# EAGLE design main (EAGLE 7.2.0)
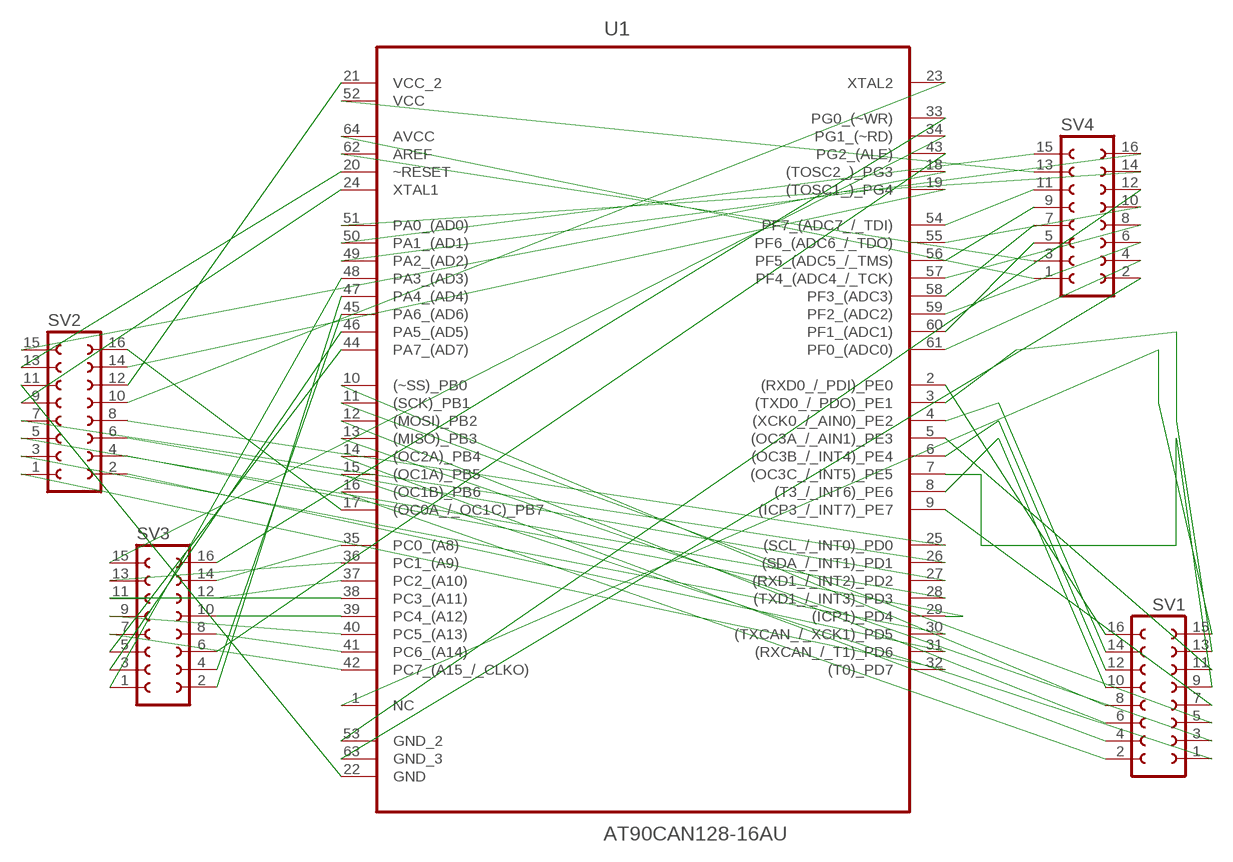
[diagram p0: schematic, sheet 1]

## Parts
SV1  FE08-2  [FE08-2]
SV2  FE08-2  [FE08-2]
SV3  FE08-2  [FE08-2]
SV4  FE08-2  [FE08-2]
U1  AT90CAN128-16AU  [QFP80P1600X1600X120-64N]

## Nets
N$1: SV4.12 U1.53(GND_2)
N$2: SV1.16 U1.2((RXD0_/_PDI)_PE0)
N$3: SV1.14 U1.4((XCK0_/_AIN0)_PE2)
N$4: SV1.12 U1.6((OC3B_/_INT4)_PE4)
N$5: SV1.10 U1.8((T3_/_INT6)_PE6)
N$6: SV1.15 U1.1(NC)
N$7: SV4.2 U1.63(GND_3)
N$8: SV1.9 U1.7((OC3C_/_INT5)_PE5)
N$9: SV1.7 U1.9((ICP3_/_INT7)_PE7)
N$10: SV1.8 U1.10((~SS)_PB0)
N$11: SV1.5 U1.11((SCK)_PB1)
N$12: SV1.6 U1.12((MOSI)_PB2)
N$13: SV1.3 U1.13((MISO)_PB3)
N$14: SV1.4 U1.14((OC2A)_PB4)
N$15: SV1.1 U1.15((OC1A)_PB5)
N$16: SV1.2 U1.16((OC1B)_PB6)
N$17: SV2.16 U1.17((OC0A_/_OC1C)_PB7)
N$18: SV2.12 U1.21(VCC_2)
N$19: SV2.13 U1.20(~RESET)
N$20: SV2.9 U1.24(XTAL1)
N$21: SV2.11 U1.22(GND)
N$22: SV2.1 U1.32((T0)_PD7)
N$23: SV2.2 U1.31((RXCAN_/_T1)_PD6)
N$24: SV2.3 U1.30((TXCAN_/_XCK1)_PD5)
N$25: SV2.4 U1.29((ICP1)_PD4)
N$26: SV2.5 U1.28((TXD1_/_INT3)_PD3)
N$27: SV2.6 U1.27((RXD1_/_INT2)_PD2)
N$28: SV2.7 U1.26((SDA_/_INT1)_PD1)
N$29: SV2.8 U1.25((SCL_/_INT0)_PD0)
N$30: SV2.10 U1.23(XTAL2)
N$31: SV2.15 U1.18((TOSC2_)_PG3)
N$32: SV2.14 U1.19((TOSC1_)_PG4)
N$33: SV3.16 U1.33(PG0_(~WR))
N$34: SV3.15 U1.34(PG1_(~RD))
N$35: SV3.14 U1.35(PC0_(A8))
N$36: SV3.13 U1.36(PC1_(A9))
N$37: SV3.12 U1.37(PC2_(A10))
N$38: SV3.11 U1.38(PC3_(A11))
N$39: SV3.10 U1.39(PC4_(A12))
N$40: SV3.9 U1.40(PC5_(A13))
N$41: SV3.8 U1.41(PC6_(A14))
N$42: SV3.7 U1.42(PC7_(A15_/_CLKO))
N$43: SV3.5 U1.44(PA7_(AD7))
N$44: SV3.4 U1.45(PA6_(AD6))
N$45: SV3.3 U1.46(PA5_(AD5))
N$46: SV3.2 U1.47(PA4_(AD4))
N$47: SV3.1 U1.48(PA3_(AD3))
N$48: SV3.6 U1.43(PG2_(ALE))
N$49: SV4.4 U1.61(PF0_(ADC0))
N$50: SV4.5 U1.60(PF1_(ADC1))
N$51: SV4.6 U1.59(PF2_(ADC2))
N$52: SV4.7 U1.58(PF3_(ADC3))
N$53: SV4.8 U1.57(PF4_(ADC4_/_TCK))
N$54: SV4.9 U1.56(PF5_(ADC5_/_TMS))
N$55: SV4.10 U1.55(PF6_(ADC6_/_TDO))
N$56: SV4.11 U1.54(PF7_(ADC7_/_TDI))
N$57: SV4.13 U1.52(VCC)
N$58: SV1.13 U1.3((TXD0_/_PDO)_PE1)
N$59: SV4.1 U1.64(AVCC)
N$60: SV4.3 U1.62(AREF)
N$61: SV4.14 U1.51(PA0_(AD0))
N$62: SV4.15 U1.50(PA1_(AD1))
N$63: SV4.16 U1.49(PA2_(AD2))
N$64: SV1.11 U1.5((OC3A_/_AIN1)_PE3)

## Library data of the parts
SV1-SV4 = con-lsta:FE08-2: FEMALE HEADER; OC_FARNELL: unknown; OC_NEWARK: unknown
U1 = Atmel_By_element14_Batch_1-00:AT90CAN128-16AU: CAN Controller; MPN: AT90CAN128-16AU; OC_FARNELL: 1455065; OC_NEWARK: 58M3860; PACKAGE: TQFP-64; SUPPLIER: Atmel

## Board
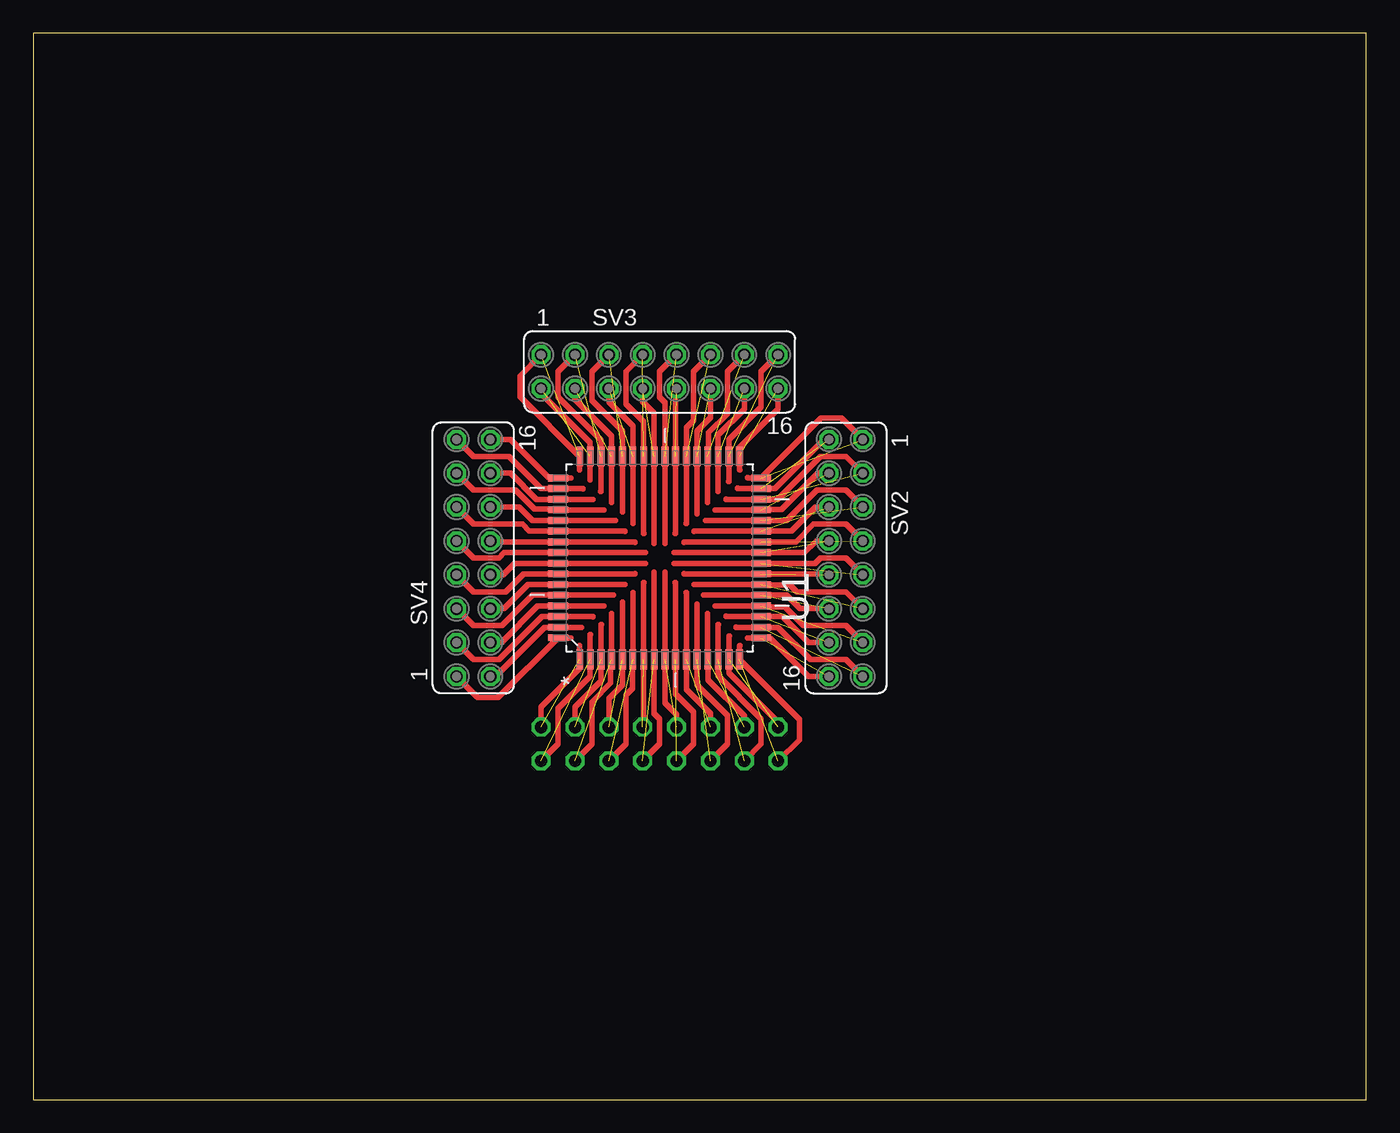
[diagram p1: board, top side]
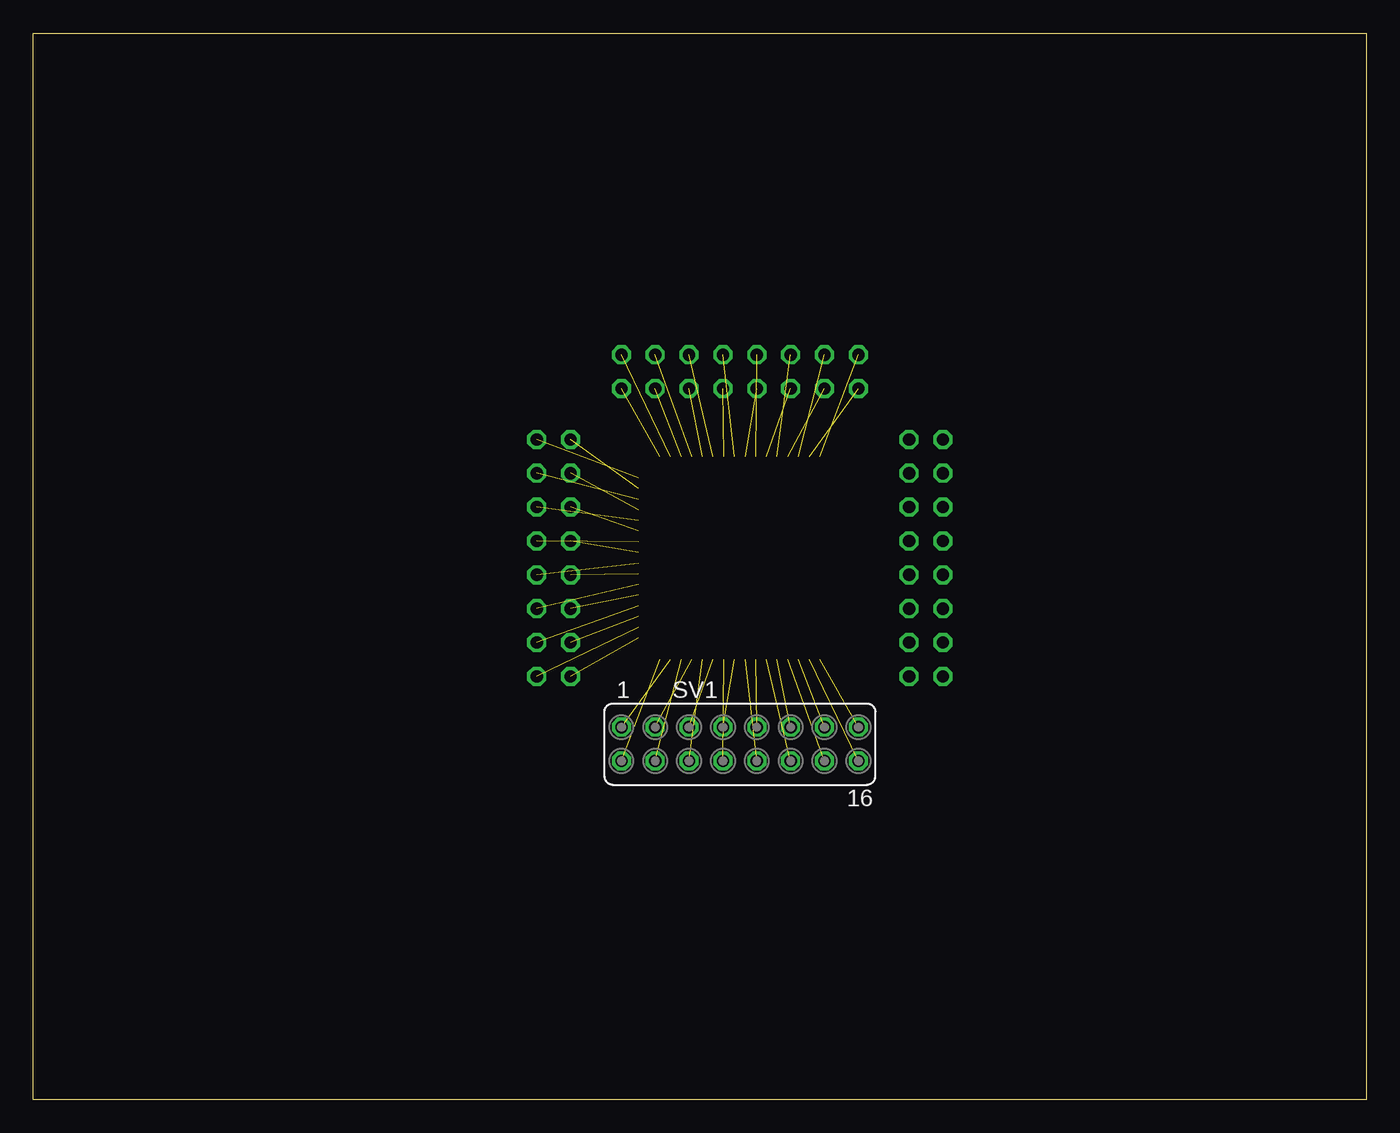
[diagram p2: board, bottom side, seen from below]

Size 100 x 80 mm. Coordinates in mm from the lower left corner, seen from the top.
Outline: 0,0 100,0 100,80 0,80 0,0
Copper layers (1*16): Top 0.035mm / dielectric 1.5mm / Bottom 0.035mm
Design rules "default": minimum track width 10mil, minimum drill 24mil, track to track 8mil, track to pad 8mil, pad to pad 8mil, via to via 8mil, smd to smd 8mil, copper to edge 40mil, drill to drill 8mil, minimum pad ring 10mil, minimum via ring 8mil, stop-mask expansion 4mil, vias tented up to drill 0mil, thermal gap 10mil

### Footprints (pad centres in the part's own frame; a part is rotated, then mirrored left to right if it is on the bottom)
FE08-2 = drill 0.914 octagon: 1 -8.89,1.27; 2 -8.89,-1.27; 3 -6.35,1.27; 4 -6.35,-1.27; 5 -3.81,1.27; 6 -3.81,-1.27; 7 -1.27,1.27; 8 -1.27,-1.27; 9 1.27,1.27; 10 1.27,-1.27; 11 3.81,1.27; 12 3.81,-1.27; 13 6.35,1.27; 14 6.35,-1.27; 15 8.89,1.27; 16 8.89,-1.27
QFP80P1600X1600X120-64N = smd 1.473 x 0.508: 1 -7.62,5.994; 2 -7.62,5.207; 3 -7.62,4.394; 4 -7.62,3.607; 5 -7.62,2.794; 6 -7.62,2.007; 7 -7.62,1.194; 8 -7.62,0.406; 9 -7.62,-0.406; 10 -7.62,-1.194; 11 -7.62,-2.007; 12 -7.62,-2.794; 13 -7.62,-3.607; 14 -7.62,-4.394; 15 -7.62,-5.207; 16 -7.62,-5.994; 33 7.62,-5.994; 34 7.62,-5.207; 35 7.62,-4.394; 36 7.62,-3.607; 37 7.62,-2.794; 38 7.62,-2.007; 39 7.62,-1.194; 40 7.62,-0.406; 41 7.62,0.406; 42 7.62,1.194; 43 7.62,2.007; 44 7.62,2.794; 45 7.62,3.607; 46 7.62,4.394; 47 7.62,5.207; 48 7.62,5.994 | smd 0.508 x 1.473: 17 -5.994,-7.62; 18 -5.207,-7.62; 19 -4.394,-7.62; 20 -3.607,-7.62; 21 -2.794,-7.62; 22 -2.007,-7.62; 23 -1.194,-7.62; 24 -0.406,-7.62; 25 0.406,-7.62; 26 1.194,-7.62; 27 2.007,-7.62; 28 2.794,-7.62; 29 3.607,-7.62; 30 4.394,-7.62; 31 5.207,-7.62; 32 5.994,-7.62; 49 5.994,7.62; 50 5.207,7.62; 51 4.394,7.62; 52 3.607,7.62; 53 2.794,7.62; 54 2.007,7.62; 55 1.194,7.62; 56 0.406,7.62; 57 -0.406,7.62; 58 -1.194,7.62; 59 -2.007,7.62; 60 -2.794,7.62; 61 -3.607,7.62; 62 -4.394,7.62; 63 -5.207,7.62; 64 -5.994,7.62

### Placement (x,y rotation side)
SV1  46.99,26.67 0 bottom
SV2  60.96,40.64 270 top
SV3  46.99,54.61 0 top
SV4  33.02,40.64 90 top
U1  46.99,40.64 90 top

### Tracks (layer width: path | path; a pad name or v marks a point on that pad's centre or on a via)
N$1
  Top 0.406: 43.69,43.43 U1.53 37.47,43.43 36.45,44.45 SV4.12
N$2  (1 unrouted)
N$3  (1 unrouted)
N$4  (1 unrouted)
N$5  (1 unrouted)
N$6  (1 unrouted)
  Top 0.406: U1.1 41,34.05 41,34.06
N$7
  Top 0.406: 41.15,35.41 41.15,35.43 U1.63 38.35,35.43 34.67,31.75 SV4.2
N$8  (1 unrouted)
N$9  (1 unrouted)
N$10  (1 unrouted)
N$11  (1 unrouted)
N$12  (1 unrouted)
N$13  (1 unrouted)
N$14  (1 unrouted)
N$15  (1 unrouted)
N$16  (1 unrouted)
  Top 0.406: U1.16 52.98,34.03 53.02,34.06
N$17  (1 unrouted)
  Top 0.406: U1.17 53.6,34.65 53.59,34.64
N$18  (1 unrouted)
N$19  (1 unrouted)
N$20  (1 unrouted)
N$21  (1 unrouted)
N$22  (1 unrouted)
  Top 0.406: U1.32 53.61,46.63 53.59,46.65
N$23  (1 unrouted)
N$24  (1 unrouted)
N$25  (1 unrouted)
N$26  (1 unrouted)
N$27  (1 unrouted)
N$28  (1 unrouted)
N$29  (1 unrouted)
N$30  (1 unrouted)
N$31  (1 unrouted)
N$32  (1 unrouted)
N$33  (1 unrouted)
  Top 0.406: U1.33 52.98,47.26 53.02,47.23
N$34  (1 unrouted)
N$35  (1 unrouted)
N$36  (1 unrouted)
N$37  (1 unrouted)
N$38  (1 unrouted)
N$39  (1 unrouted)
N$40  (1 unrouted)
N$41  (1 unrouted)
N$42  (1 unrouted)
N$43  (1 unrouted)
N$44  (1 unrouted)
N$45  (1 unrouted)
N$46  (1 unrouted)
N$47  (1 unrouted)
  Top 0.406: U1.48 41,47.24 41,47.23
N$48  (1 unrouted)
N$49
  Top 0.406: 42.82,37.03 U1.61 39.36,37.02 37.85,37.02 35.12,34.29 SV4.4
N$50
  Top 0.406: 43.54,37.85 U1.60 37.47,37.85 35.18,35.56 33.02,35.56 SV4.5
N$51
  Top 0.406: 44.4,38.66 44.4,38.63 U1.59 37.11,38.63 35.31,36.83 SV4.6
N$52
  Top 0.406: 45.16,39.47 45.16,39.45 U1.58 39.36,39.43 36.77,39.43 35.43,38.1 33.02,38.1 SV4.7
N$53
  Top 0.406: 45.92,40.23 U1.57 36.11,40.23 35.24,39.37 SV4.8
N$54
  Top 0.406: 45.92,41.05 U1.56 35.33,41.05 34.92,40.64 33.02,40.64 SV4.9
N$55
  Top 0.406: 45.16,41.81 45.16,41.83 U1.55 34.37,41.83 SV4.10
N$56
  Top 0.406: 44.4,42.62 44.4,42.65 U1.54 39.34,42.67 37.21,42.67 36.7,43.18 33.02,43.18 SV4.11
N$57
  Top 0.406: 42.82,44.25 U1.52 39.29,44.32 37.59,44.32 36.2,45.72 33.02,45.72 SV4.13
N$58  (1 unrouted)
N$59
  Top 0.406: 40.34,34.65 U1.64 34.89,30.16 33.34,30.16 SV4.1
N$60
  Top 0.406: 42.01,36.22 42.01,36.25 U1.62 38.15,36.25 34.92,33.02 33.02,33.02 SV4.3
N$61
  Top 0.406: 42.01,45.01 42.01,45.03 U1.51 37.77,45.03 35.81,46.99 SV4.14
N$62
  Top 0.406: 41.25,45.82 41.25,45.85 U1.50 38.1,45.85 35.69,48.26 33.02,48.26 SV4.15
N$63
  Top 0.406: 40.34,46.63 U1.49 38.71,46.63 35.81,49.53 SV4.16
N$64  (1 unrouted)
N$65
  Top 0.406: 50.6,36.47 50.6,33.02 50.61,33.01 50.61,31.5 53.34,28.77 53.34,27.94
N$66
  Top 0.406: 49.78,37.19 49.78,33.02 49.78,31.11 52.07,28.83 52.07,26.67 50.8,25.4
N$67
  Top 0.406: 50.6,33.02 50.6,36.47
N$68
  Top 0.406: 49.78,33.02 49.78,37.19
N$69
  Top 0.406: 49,33.02 49,38.05 48.97,38.05
N$70
  Top 0.406: 48.18,33.02 48.18,38.81 48.16,38.81
N$71
  Top 0.406: 47.4,33.02 47.4,39.57
N$72
  Top 0.406: 46.58,33.02 46.58,39.57
N$73
  Top 0.406: 45.8,33.02 45.8,38.81 45.82,38.81
N$74
  Top 0.406: 44.98,33.02 44.98,38.05 45.01,38.05
N$75
  Top 0.406: 44.2,33.02 44.2,37.34
N$76
  Top 0.406: 52.2,33.02 52.2,34.8 52.22,34.8
N$77
  Top 0.406: 43.38,33.02 43.38,36.47
N$78
  Top 0.406: 51.38,33.02 51.38,35.66 51.41,35.66
N$79
  Top 0.406: 42.6,33.02 42.6,35.66 42.62,35.66
N$80
  Top 0.406: 41.78,33.02 41.78,34.9 41.81,34.9
N$81
  Top 0.406: 54.61,44.25 51.16,44.25
N$82
  Top 0.406: 54.61,43.43 50.44,43.43
N$83
  Top 0.406: 54.61,42.65 49.58,42.65 49.58,42.62
N$84
  Top 0.406: 54.61,41.83 48.82,41.83 48.82,41.81
N$85
  Top 0.406: 54.61,41.05 48.06,41.05
N$86
  Top 0.406: 54.61,40.23 48.06,40.23
N$87
  Top 0.406: 54.61,39.45 48.82,39.45 48.82,39.47
N$88
  Top 0.406: 54.61,38.63 49.58,38.63 49.58,38.66
N$89
  Top 0.406: 54.61,37.85 50.29,37.85
N$90
  Top 0.406: 54.61,45.85 52.83,45.85 52.83,45.87
N$91
  Top 0.406: 54.61,37.03 51.16,37.03
N$92
  Top 0.406: 54.61,45.03 51.97,45.03 51.97,45.06
N$93
  Top 0.406: 54.61,36.25 51.97,36.25 51.97,36.27
N$94
  Top 0.406: 54.61,35.43 52.73,35.43 52.73,35.46
N$95
  Top 0.406: 43.38,48.26 43.38,44.81
N$96
  Top 0.406: 44.2,48.26 44.2,44.09
N$97
  Top 0.406: 44.98,48.26 44.98,43.23 45.01,43.23
N$98
  Top 0.406: 45.8,48.26 45.8,42.47 45.82,42.47
N$99
  Top 0.406: 46.58,48.26 46.58,41.71
N$100
  Top 0.406: 47.4,48.26 47.4,41.71
N$101
  Top 0.406: 48.18,48.26 48.18,42.47 48.16,42.47
N$102
  Top 0.406: 49,48.26 49,43.23 48.97,43.23
N$103
  Top 0.406: 49.78,48.26 49.78,43.94
N$104
  Top 0.406: 41.78,48.26 41.78,46.48 41.76,46.48
N$105
  Top 0.406: 50.6,48.26 50.6,44.81
N$106
  Top 0.406: 42.6,48.26 42.6,45.62 42.57,45.62
N$107
  Top 0.406: 51.38,48.26 51.38,45.62 51.36,45.62
N$108
  Top 0.406: 52.2,48.26 52.2,46.38 52.17,46.38
N$109
  Top 0.406: 49,38.05 49,33.02 49,30.76 50.8,28.96 50.8,27.94
N$110
  Top 0.406: 48.18,38.81 48.18,33.02 48.2,33.01 48.2,30.42 49.53,29.08 49.53,26.67 48.26,25.4
N$111
  Top 0.406: 47.4,39.57 47.4,33.02 47.4,29.76 48.26,28.89 48.26,27.94
N$112
  Top 0.406: 46.58,39.57 46.58,33.02 46.58,28.98 46.99,28.57 46.99,26.67 45.72,25.4
N$113
  Top 0.406: 45.8,38.81 45.8,33.02 45.8,28.02 45.72,27.94
N$114
  Top 0.406: 44.98,38.05 44.98,33.02 44.96,32.99 44.96,30.86 44.45,30.35 44.45,26.67 43.18,25.4
N$115
  Top 0.406: 44.2,37.34 44.2,33.02 44.2,31.11 43.18,30.1 43.18,27.94
N$116
  Top 0.406: 52.2,34.8 52.2,33.02 52.2,32 55.88,28.32 55.88,27.94
N$117
  Top 0.406: 43.38,36.47 43.38,33.02 43.31,32.94 43.31,31.24 41.91,29.84 41.91,26.67 40.64,25.4
N$118
  Top 0.406: 52.98,33.98 52.98,33.02 57.47,28.54 57.47,26.99 55.88,25.4
N$119
  Top 0.406: 51.38,35.66 51.38,33.02 51.38,31.8 54.61,28.57 54.61,26.67 53.34,25.4
N$120
  Top 0.406: 42.6,35.66 42.6,33.02 42.6,31.42 40.64,29.46 40.64,27.94
N$121
  Top 0.406: 41.78,34.9 41.78,33.02 41.78,31.75 39.37,29.34 39.37,26.67 38.1,25.4
N$122
  Top 0.406: 41,33.98 41,33.02 41,32.36 38.1,29.46 38.1,27.94
N$123
  Top 0.406: 43.38,44.81 43.38,48.26 43.37,48.27 43.37,49.78 40.64,52.51 40.64,53.34
N$124
  Top 0.406: 44.2,44.09 44.2,48.26 44.2,50.16 41.91,52.45 41.91,54.61 43.18,55.88
N$125
  Top 0.406: 44.98,43.23 44.98,48.26 44.98,50.52 43.18,52.32 43.18,53.34
N$126
  Top 0.406: 45.8,42.47 45.8,48.26 45.78,48.27 45.78,50.86 44.45,52.2 44.45,54.61 45.72,55.88
N$127
  Top 0.406: 46.58,41.71 46.58,48.26 46.58,51.52 45.72,52.39 45.72,53.34
N$128
  Top 0.406: 47.4,41.71 47.4,48.26 47.4,52.3 46.99,52.7 46.99,54.61 48.26,55.88
N$129
  Top 0.406: 48.18,42.47 48.18,48.26 48.18,53.26 48.26,53.34
N$130
  Top 0.406: 49,43.23 49,48.26 49.02,48.28 49.02,50.42 49.53,50.93 49.53,54.61 50.8,55.88
N$131
  Top 0.406: 49.78,43.94 49.78,48.26 49.78,50.16 50.8,51.18 50.8,53.34
N$132
  Top 0.406: 41.78,46.48 41.78,48.26 41.78,49.28 38.1,52.96 38.1,53.34
N$133
  Top 0.406: 50.6,44.81 50.6,48.26 50.67,48.34 50.67,50.04 52.07,51.44 52.07,54.61 53.34,55.88
N$134
  Top 0.406: 41,47.3 41,48.26 36.51,52.74 36.51,54.29 38.1,55.88
N$135
  Top 0.406: 42.6,45.62 42.6,48.26 42.6,49.48 39.37,52.7 39.37,54.61 40.64,55.88
N$136
  Top 0.406: 51.38,45.62 51.38,48.26 51.38,49.86 53.34,51.82 53.34,53.34
N$137
  Top 0.406: 52.2,46.38 52.2,48.26 52.2,49.53 54.61,51.94 54.61,54.61 55.88,55.88
N$138
  Top 0.406: 52.98,47.3 52.98,48.26 52.98,48.92 55.88,51.82 55.88,53.34
N$139
  Top 0.406: 51.16,44.25 54.61,44.25 54.62,44.26 56.13,44.26 58.86,46.99 59.69,46.99
N$140
  Top 0.406: 50.44,43.43 54.61,43.43 56.52,43.43 58.8,45.72 60.96,45.72 62.23,44.45
N$141
  Top 0.406: 49.58,42.65 54.61,42.65 56.87,42.65 58.67,44.45 59.69,44.45
N$142
  Top 0.406: 48.82,41.83 54.61,41.83 54.62,41.85 57.21,41.85 58.55,43.18 60.96,43.18 62.23,41.91
N$143
  Top 0.406: 48.06,41.05 54.61,41.05 57.87,41.05 58.74,41.91 59.69,41.91
N$144
  Top 0.406: 48.06,40.23 54.61,40.23 58.65,40.23 59.05,40.64 60.96,40.64 62.23,39.37
N$145
  Top 0.406: 48.82,39.45 54.61,39.45 59.61,39.45 59.69,39.37
N$146
  Top 0.406: 49.58,38.63 54.61,38.63 54.63,38.61 56.77,38.61 57.28,38.1 60.96,38.1 62.23,36.83
N$147
  Top 0.406: 50.29,37.85 54.61,37.85 56.52,37.85 57.53,36.83 59.69,36.83
N$148
  Top 0.406: 52.83,45.85 54.61,45.85 55.63,45.85 59.31,49.53 59.69,49.53
N$149
  Top 0.406: 51.16,37.03 54.61,37.03 54.69,36.96 56.39,36.96 57.78,35.56 60.96,35.56 62.23,34.29
N$150
  Top 0.406: 53.65,46.63 54.61,46.63 59.09,51.12 60.64,51.12 62.23,49.53
N$151
  Top 0.406: 51.97,45.03 54.61,45.03 55.83,45.03 59.05,48.26 60.96,48.26 62.23,46.99
N$152
  Top 0.406: 51.97,36.25 54.61,36.25 56.21,36.25 58.17,34.29 59.69,34.29
N$153
  Top 0.406: 52.73,35.43 54.61,35.43 55.88,35.43 58.29,33.02 60.96,33.02 62.23,31.75
N$154
  Top 0.406: 53.65,34.65 54.61,34.65 55.27,34.65 58.17,31.75 59.69,31.75